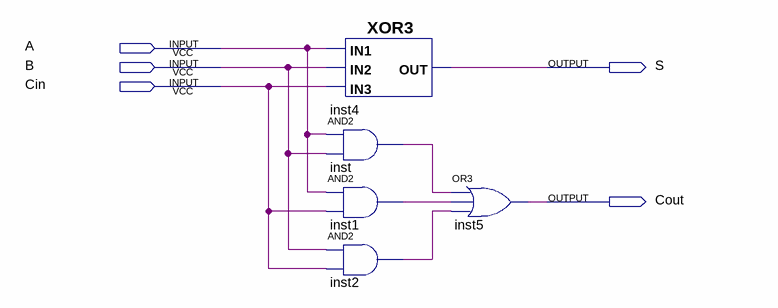
[diagram p0: schematic sheet]
// Quartus schematic FullAdder.bdf as structural Verilog: 5 symbols, 5 pins
module FullAdder (
  input  A,
  input  B,
  input  Cin,
  output S,
  output Cout
);

  wire inst1_out, inst2_out, inst_out;

  XOR3 inst4 (.IN3(Cin), .IN1(A), .IN2(B), .OUT(S));
  and inst (inst_out, A, B);
  and inst1 (inst1_out, A, Cin);
  and inst2 (inst2_out, B, Cin);
  or inst5 (Cout, inst_out, inst1_out, inst2_out);
endmodule
